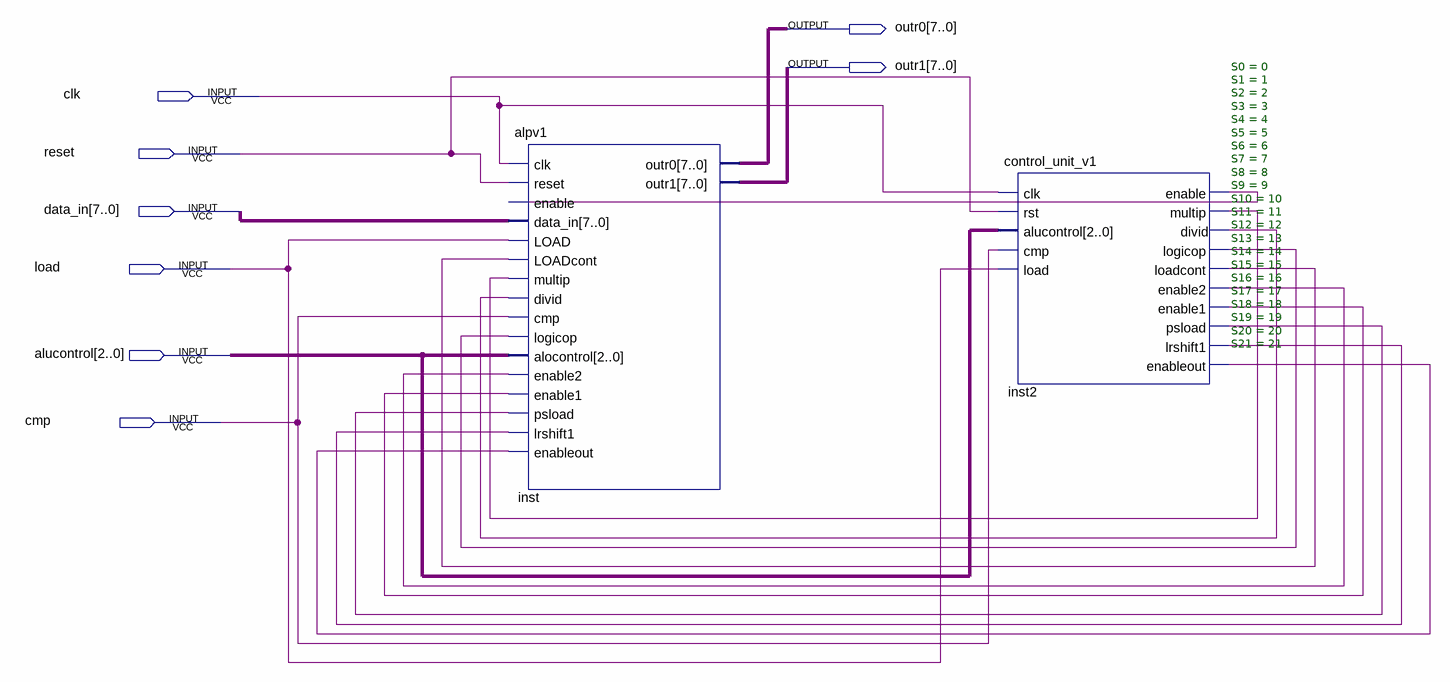
[diagram p0: schematic sheet]
// Quartus schematic overall_v1.bdf as structural Verilog: 2 symbols, 8 pins
module overall_v1 (
  input  clk,
  input  reset,
  input  [7:0] data_in,
  input  load,
  input  [2:0] alucontrol,
  input  cmp,
  output [7:0] outr0,
  output [7:0] outr1
);

  wire inst2_divid, inst2_enable, inst2_enable1, inst2_enable2, inst2_enableout, inst2_loadcont,
       inst2_logicop, inst2_lrshift1, inst2_multip, inst2_psload;

  alpv1 inst (
    .clk(clk), .reset(reset), .enable(inst2_enable), .data_in(data_in), .LOAD(load),
    .LOADcont(inst2_loadcont), .multip(inst2_multip), .divid(inst2_divid), .cmp(cmp),
    .logicop(inst2_logicop), .alocontrol(alucontrol), .enable2(inst2_enable2), .enable1(inst2_enable1),
    .psload(inst2_psload), .lrshift1(inst2_lrshift1), .enableout(inst2_enableout), .outr0(outr0),
    .outr1(outr1));
  control_unit_v1 #(.S0(0), .S1(1), .S2(2), .S3(3), .S4(4), .S5(5), .S6(6), .S7(7), .S8(8), .S9(9), .S10(10), .S11(11), .S12(12), .S13(13), .S14(14), .S15(15), .S16(16), .S17(17), .S18(18), .S19(19), .S20(20), .S21(21)) inst2 (
    .clk(clk), .rst(reset), .alucontrol(alucontrol), .cmp(cmp), .load(load), .enable(inst2_enable),
    .multip(inst2_multip), .divid(inst2_divid), .logicop(inst2_logicop), .loadcont(inst2_loadcont),
    .enable2(inst2_enable2), .enable1(inst2_enable1), .psload(inst2_psload), .lrshift1(inst2_lrshift1),
    .enableout(inst2_enableout));
endmodule
